# EAGLE design DueShield (EAGLE 9.0.0)
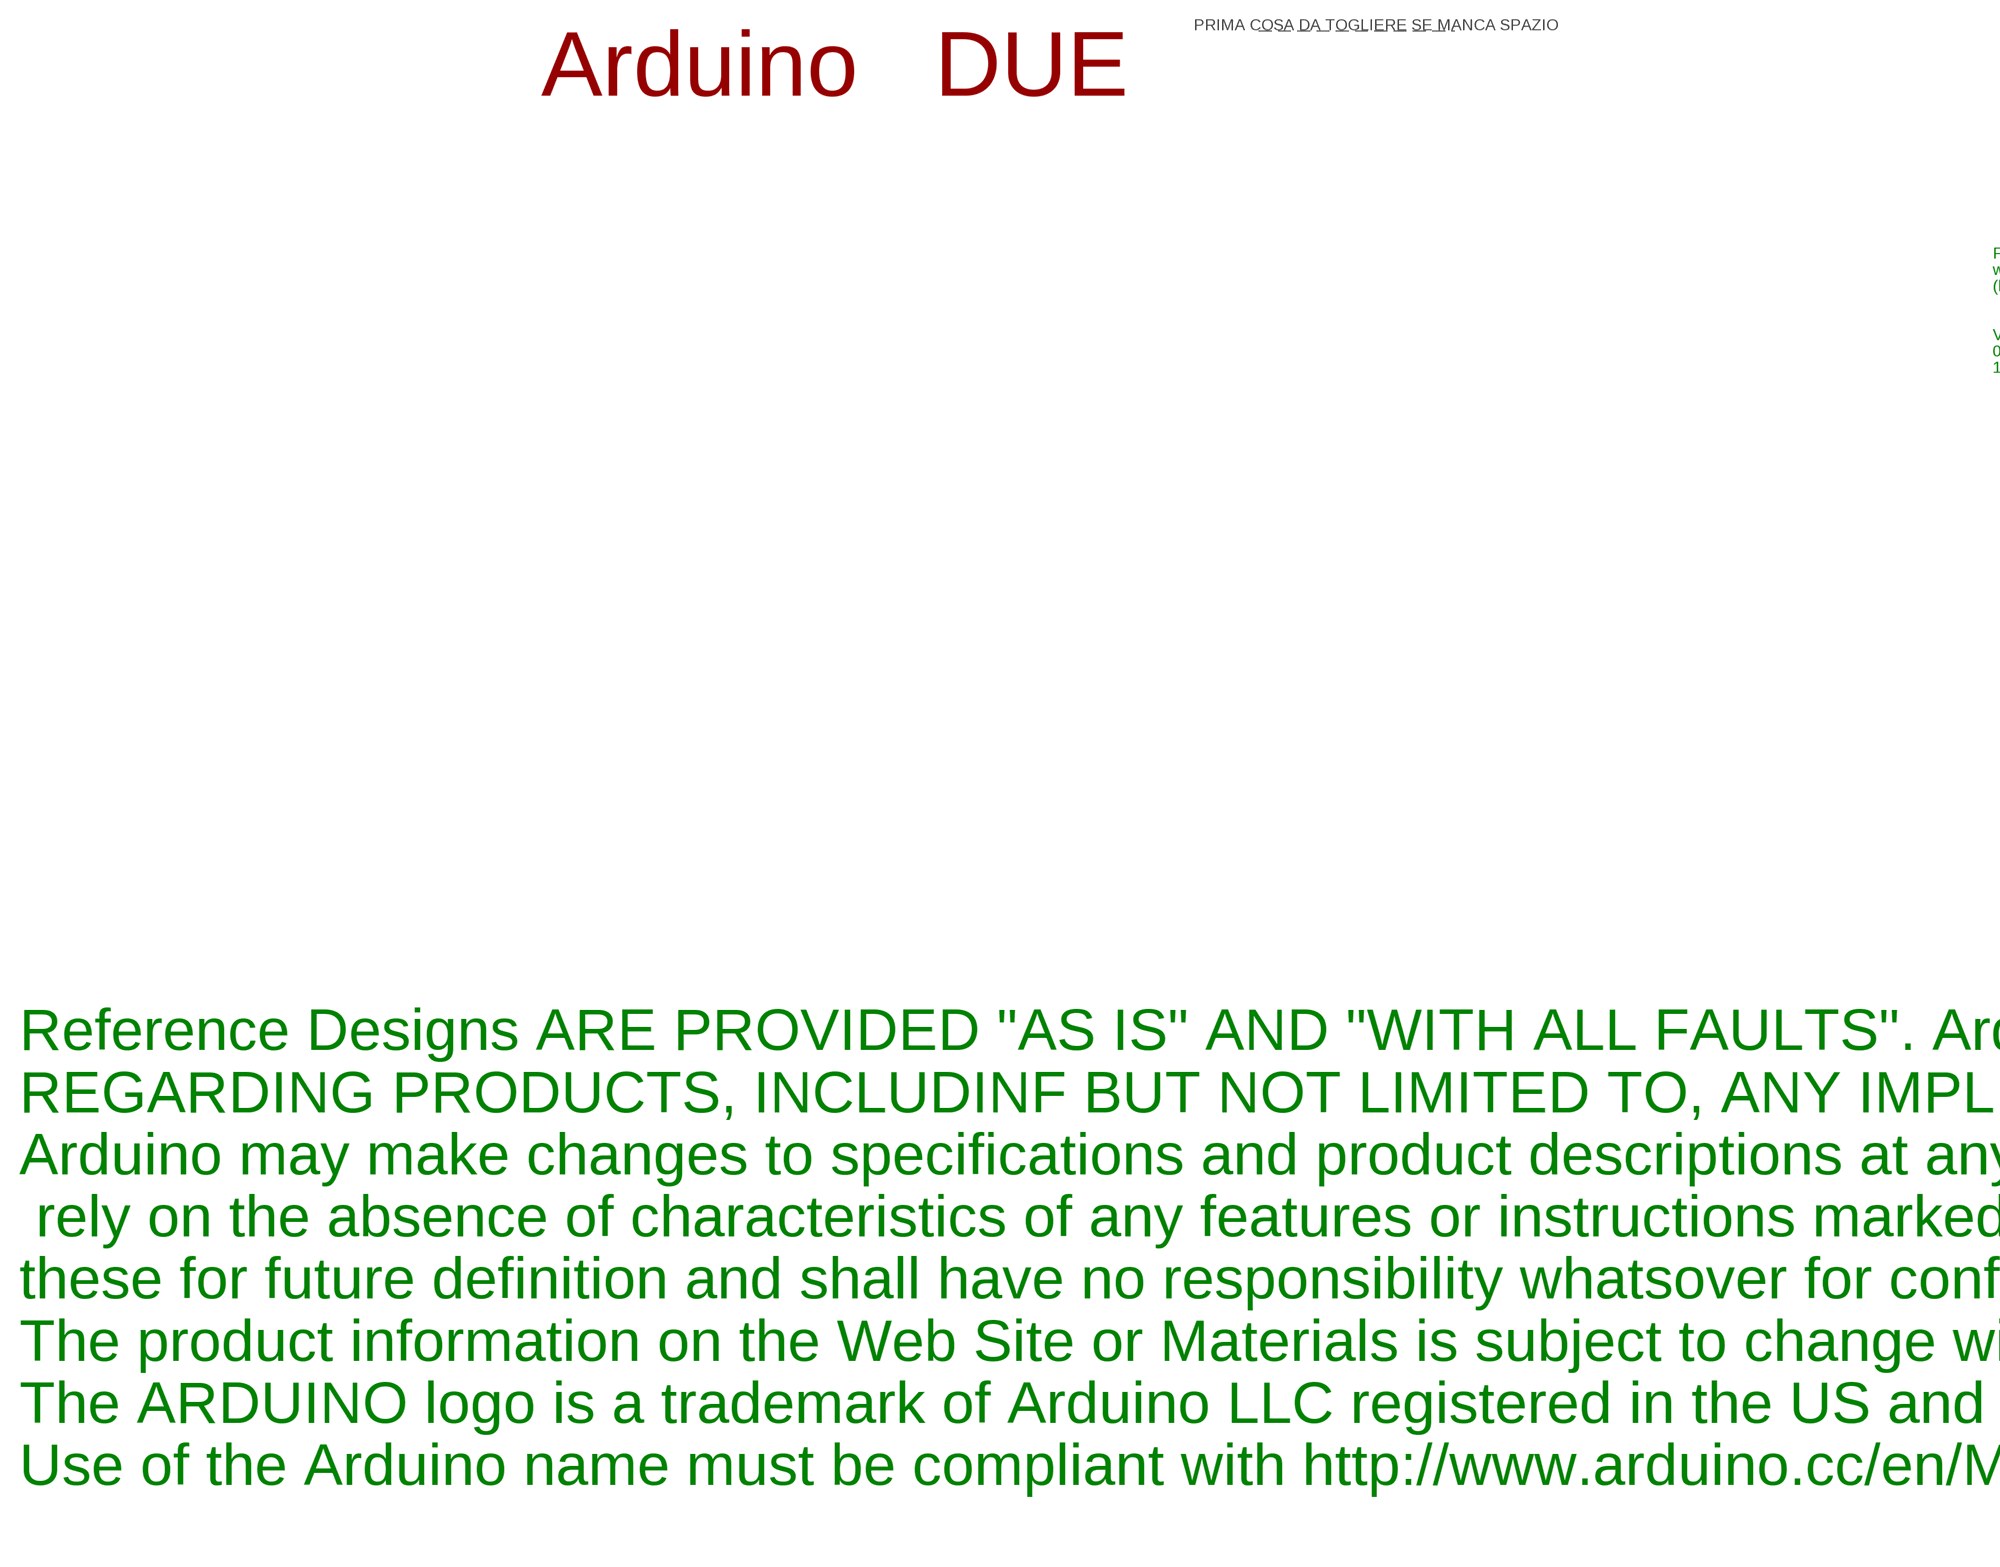
[diagram p0: schematic, sheet 1, part 1 of 2]
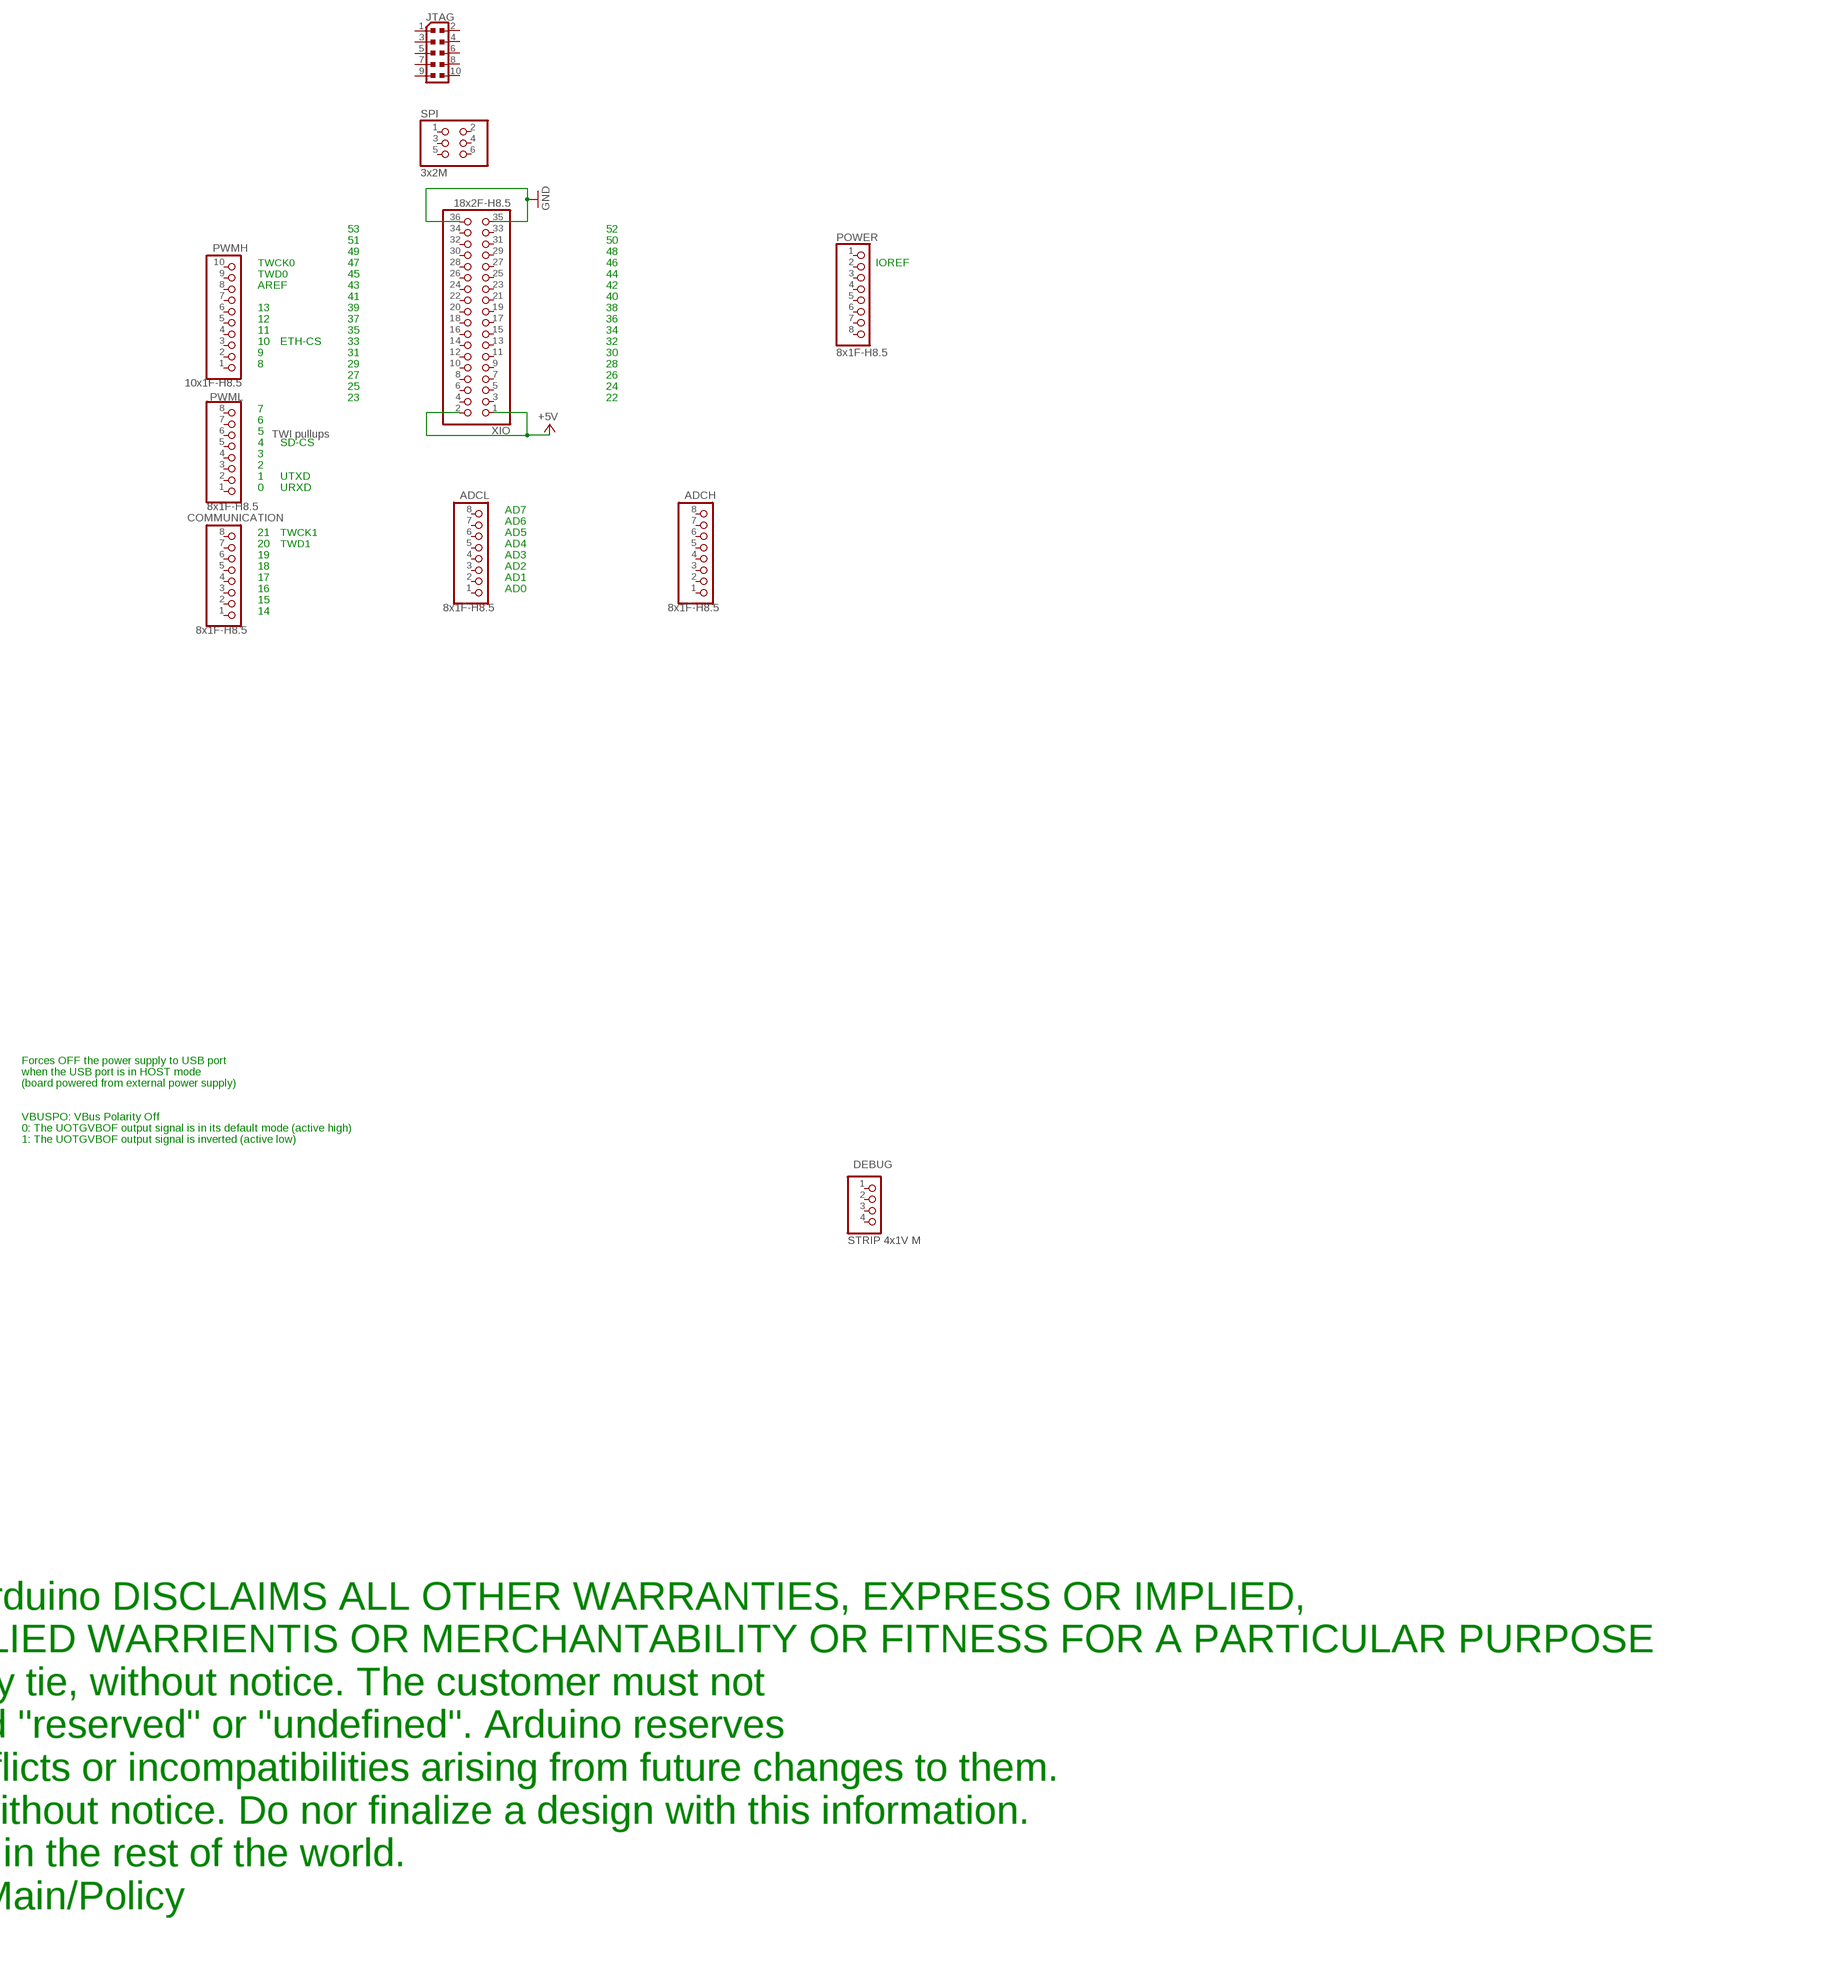
[diagram p1: schematic, sheet 1, part 2 of 2]

## Parts
ADCH  8x1F-H8.5  PINHD-1X8  [1X08]
ADCL  8x1F-H8.5  PINHD-1X8  [1X08]
COMMUNICATION  8x1F-H8.5  PINHD-1X8  [1X08]
DEBUG  STRIP 4x1V M  PINHD-1X4  [1X04]
JTAG  PINHEAD_PINHD-2X5PASSO127  [PINHEAD_2X05_127]
POWER  8x1F-H8.5  PINHD-1X8  [1X08]
PWMH  10x1F-H8.5  PINHD-1X10  [1X10]
PWML  8x1F-H8.5  PINHD-1X8  [1X08]
SPI  3x2M  PINHD-2X3  [2X03]
XIO  18x2F-H8.5  PINHD-2X18  [2X18]

## Nets
+5V: XIO.1 XIO.2
GND: XIO.35 XIO.36
Unconnected: ADCH.1 ADCH.2 ADCH.3 ADCH.4 ADCH.5 ADCH.6 ADCH.7 ADCH.8 ADCL.1 ADCL.2 ADCL.3 ADCL.4 ADCL.5 ADCL.6 ADCL.7 ADCL.8 COMMUNICATION.1 COMMUNICATION.2 COMMUNICATION.3 COMMUNICATION.4 COMMUNICATION.5 COMMUNICATION.6 COMMUNICATION.7 COMMUNICATION.8 DEBUG.1 DEBUG.2 DEBUG.3 DEBUG.4 JTAG.1 JTAG.2 JTAG.3 JTAG.4 JTAG.5 JTAG.6 JTAG.7 JTAG.8 JTAG.9 JTAG.10 POWER.1 POWER.2 POWER.3 POWER.4 POWER.5 POWER.6 POWER.7 POWER.8 PWMH.1 PWMH.2 PWMH.3 PWMH.4 PWMH.5 PWMH.6 PWMH.7 PWMH.8 PWMH.9 PWMH.10 PWML.1 PWML.2 PWML.3 PWML.4 PWML.5 PWML.6 PWML.7 PWML.8 SPI.1 SPI.2 SPI.3 SPI.4 SPI.5 SPI.6 XIO.3 XIO.4 XIO.5 XIO.6 XIO.7 XIO.8 XIO.9 XIO.10 XIO.11 XIO.12 XIO.13 XIO.14 XIO.15 XIO.16 XIO.17 XIO.18 XIO.19 XIO.20 XIO.21 XIO.22 XIO.23 XIO.24 XIO.25 XIO.26 XIO.27 XIO.28 XIO.29 XIO.30 XIO.31 XIO.32 XIO.33 XIO.34

## Notes on the sheet
- 53 | 52
- 51 | 50
- 49 | 48
- TWCK0 | 47 | 46 | IOREF
- TWD0 | 45 | 44
- AREF | 43 | 42
- 41 | 40
- 13 | 39 | 38
- 12 | 37 | 36
- 11 | 35 | 34
- 10 | ETH-CS | 33 | 32
- 9 | 31 | 30
- 8 | 29 | 28
- 27 | 26
- 25 | 24
- 23 | 22
- 7
- 6
- 5 | TWI pullups
- 4 | SD-CS
- 3
- 2
- 1 | UTXD
- 0 | URXD
- AD7
- AD6
- 21 | TWCK1 | AD5
- 20 | TWD1 | AD4
- 19 | AD3
- 18 | AD2
- 17 | AD1
- 16 | AD0
- 15
- 14
- PRIMA COSA DA TOGLIERE SE MANCA SPAZIO
- Arduino   DUE
- Forces OFF the power supply to USB port
- when the USB port is in HOST mode
- (board powered from external power supply)
- VBUSPO: VBus Polarity Off
- 0: The UOTGVBOF output signal is in its default mode (active high)
- 1: The UOTGVBOF output signal is inverted (active low)
- Reference Designs ARE PROVIDED "AS IS" AND "WITH ALL FAULTS". Arduino DISCLAIMS ALL OTHER WARRANTIES, EXPRESS OR IMPLIED,
  REGARDING PRODUCTS, INCLUDINF BUT NOT LIMITED TO, ANY IMPLIED WARRIENTIS OR MERCHANTABILITY OR FITNESS FOR A PARTICULAR PURPOSE
  Arduino may make changes to specifications and product descriptions at any tie, without notice. The customer must not
   rely on the absence of characteristics of any features or instructions marked "reserved" or "undefined". Arduino reserves
  these for future definition and shall have no responsibility whatsover for conflicts or incompatibilities arising from future changes to them.
  The product information on the Web Site or Materials is subject to change without notice. Do nor finalize a design with this information.
  The ARDUINO logo is a trademark of Arduino LLC registered in the US and in the rest of the world.
  Use of the Arduino name must be compliant with http://www.arduino.cc/en/Main/Policy

## Library data of the parts
ADCH ADCL COMMUNICATION POWER PWML = SmartPrj:PINHD-1X8: PIN HEADER
DEBUG = pinhead:PINHD-1X4: PIN HEADER
JTAG = Arduino_Wifi_shield_v018_tG:PINHEAD_PINHD-2X5: PIN HEADER
PWMH = SmartPrj:PINHD-1X10: PIN HEADER
SPI = SmartPrj:PINHD-2X3: PIN HEADER
XIO = SmartPrj:PINHD-2X18: PIN HEADER

## Net classes
0 default: width 0.203 mm, drill 0.406 mm, clearance 0.203 mm
1 USB: width 0.203 mm, drill 0.406 mm, clearance 0.203 mm
2 gnd: width 0.203 mm, drill 0.406 mm, clearance 0.203 mm
3 usbvcc: width 0.203 mm, drill 0.406 mm, clearance 0.203 mm
4 USBpair: width 0.254 mm, drill 0.406 mm, clearance 0.61 mm

## Board
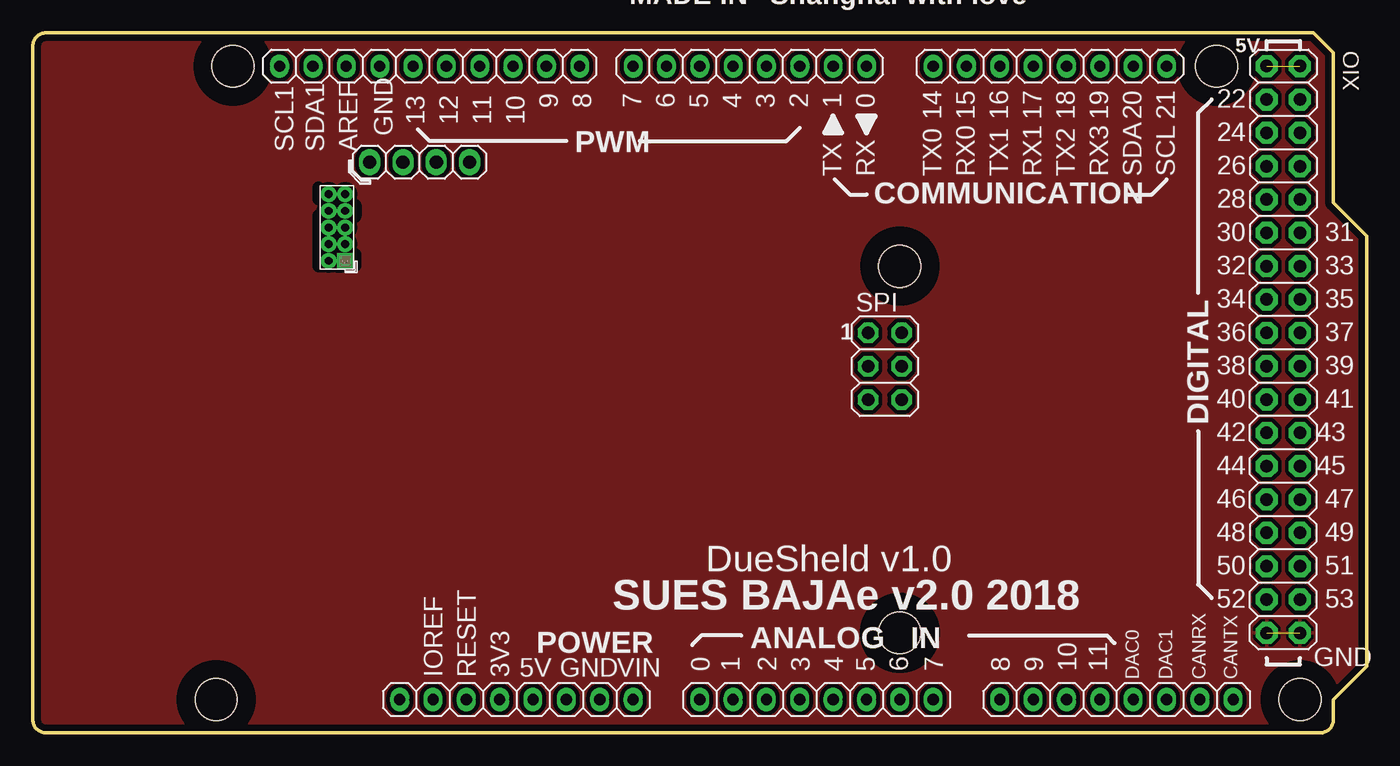
[diagram p2: board, top side]
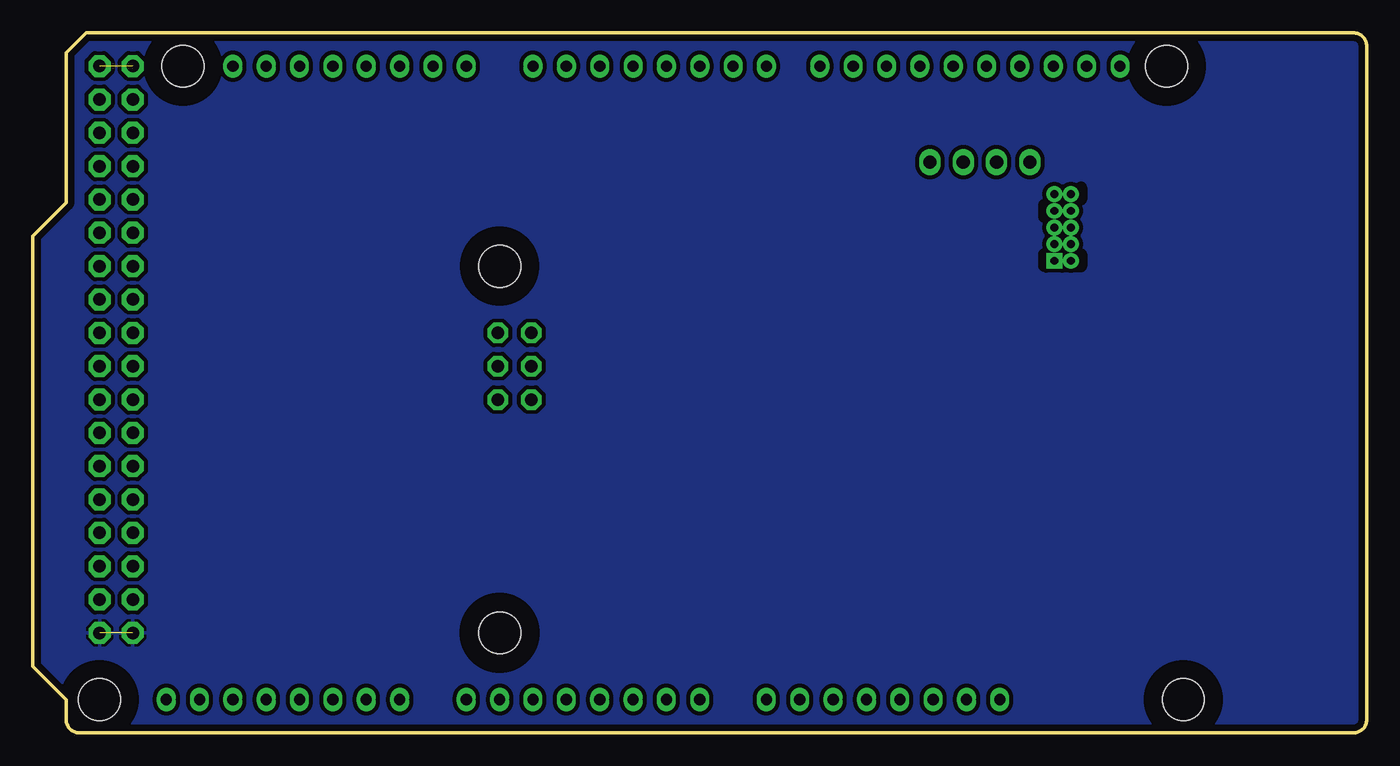
[diagram p3: board, bottom side, seen from below]

Size 101.6 x 53.34 mm. Coordinates in mm from the lower left corner, seen from the top.
Outline: 97.54,53.34 99.06,51.82 99.06,40.39 101.6,37.85 101.6,5.08 99.06,2.54 99.06,1 arc-90 98.06,0 1,0 arc-90 0,1 0,52.34 arc-90 1,53.34 97.54,53.34
Copper layers (1*16): Top 0.035mm / dielectric 1.6mm / Bottom 0.035mm
Design rules "default *": minimum track width 8mil, minimum drill 16mil, track to track 8mil, track to pad 8mil, pad to pad 8mil, via to via 8mil, smd to smd 6mil, copper to edge 20mil, drill to drill 12mil, minimum pad ring 12mil, minimum via ring 8mil, stop-mask expansion 2mil, vias tented up to drill 25mil, thermal gap 8mil
Holes 3.2 mm at 96.52,2.54 15.24,50.8 90.17,50.8 13.97,2.54 66.04,35.56 66.04,7.62
tRestrict: area 63.5,5.1 to 68.6,10.2; area 12.7,48.3 to 17.8,53.3; area 63.5,33 to 68.6,38.1; area 87.6,48.3 to 92.7,53.3; area 94,0 to 99.1,5.1; area 11.4,0 to 16.5,5.1; 5 lines
bRestrict: area 63.5,5.1 to 68.6,10.2; area 12.7,48.3 to 17.8,53.3; area 63.5,33 to 68.6,38.1; area 87.6,48.3 to 92.7,53.3; area 94,0 to 99.1,5.1; area 11.4,0 to 16.5,5.1; 5 lines

### Footprints (pad centres in the part's own frame; a part is rotated, then mirrored left to right if it is on the bottom)
1X08 = drill 0.85 pad 1.422 long: 1 -8.89,0; 2 -6.35,0; 3 -3.81,0; 4 -1.27,0; 5 1.27,0; 6 3.81,0; 7 6.35,0; 8 8.89,0
1X04 = drill 1.016 long: 1 -3.81,0; 2 -1.27,0; 3 1.27,0; 4 3.81,0
PINHEAD_2X05_127 = drill 0.6 pad 1.016 square: 1 -0.635,2.54 | drill 0.6 pad 1.016: 2 0.635,2.54; 3 -0.635,1.27; 4 0.635,1.27; 5 -0.635,0; 6 0.635,0; 7 -0.635,-1.27; 8 0.635,-1.27; 9 -0.635,-2.54; 10 0.635,-2.54
1X10 = drill 0.85 pad 1.422 long: 1 -11.43,0; 2 -8.89,0; 3 -6.35,0; 4 -3.81,0; 5 -1.27,0; 6 1.27,0; 7 3.81,0; 8 6.35,0; 9 8.89,0; 10 11.43,0
2X03 = drill 0.95 pad 1.55 octagon: 1 -2.54,-1.27; 2 -2.54,1.27; 3 0,-1.27; 4 0,1.27; 5 2.54,-1.27; 6 2.54,1.27
2X18 = drill 0.95 pad 1.676 octagon: 1 -21.59,-1.27; 2 -21.59,1.27; 3 -19.05,-1.27; 4 -19.05,1.27; 5 -16.51,-1.27; 6 -16.51,1.27; 7 -13.97,-1.27; 8 -13.97,1.27; 9 -11.43,-1.27; 10 -11.43,1.27; 11 -8.89,-1.27; 12 -8.89,1.27; 13 -6.35,-1.27; 14 -6.35,1.27; 15 -3.81,-1.27; 16 -3.81,1.27; 17 -1.27,-1.27; 18 -1.27,1.27; 19 1.27,-1.27; 20 1.27,1.27; 21 3.81,-1.27; 22 3.81,1.27; 23 6.35,-1.27; 24 6.35,1.27; 25 8.89,-1.27; 26 8.89,1.27; 27 11.43,-1.27; 28 11.43,1.27; 29 13.97,-1.27; 30 13.97,1.27; 31 16.51,-1.27; 32 16.51,1.27; 33 19.05,-1.27; 34 19.05,1.27; 35 21.59,-1.27; 36 21.59,1.27

### Placement (x,y rotation side)
ADCH  82.55,2.54 0 top
ADCL  59.69,2.54 0 top
COMMUNICATION  77.47,50.8 0 top
DEBUG  29.46,43.48 180 top
JTAG  23.16,38.51 180 top
POWER  36.83,2.54 0 top
PWMH  30.23,50.8 180 top
PWML  54.61,50.8 180 top
SPI  64.9,27.94 270 top
XIO  95.25,29.21 270 top

### Tracks (layer width: path | path; a pad name or v marks a point on that pad's centre or on a via)
+5V  (1 unrouted)
GND  (1 unrouted)
  pour Top (isolate 0.305, rank 2): 102.11,53.85 102.11,-0.51 -1.02,-0.51 -1.02,52.83 arc-89 0,53.85
  pour Bottom (isolate 0.305, rank 2): -0.51,54.86 103.12,54.86 103.12,-1.52 -1.52,-1.52 -1.52,53.34 arc-90

### Text on the board
tPlace: 9 | 8 | 7 | 6 | 5 | 4 | 3 | 2 | 1 | 0 | 22 | 14 | 15 | 16 | 17 | 18 | 19 | 20 | 21 | 13 | 12 | 11 | 10 | 24 | 26 | 28 | 30 | 31 | 32 | 33 | 34 | 35 | 36 | 37 | 38 | 39 | 40 | 41 | 42 | 43 | 44 | 45 | 46 | 47 | 48 | 49 | 50 | 51 | 52 | 53 | 0 | 1 | 2 | 3 | 4 | 5 | 6 | 7 | 8 | 9 | 10 | 11 | DAC0 | DAC1 | CANRX | CANTX
tNames: MADE IN | Shanghai with love | 5V | GND | SCL1 | SDA1 | AREF | PWM | TX | RX | TX0 | RX0 | TX1 | RX1 | TX2 | RX3 | SDA | SCL | 1 | DIGITAL | DueSheld v1.0 | SUES BAJAe v2.0 2018 | ANALOG IN | GND | IOREF | RESET | 3V3 | 5V | GND | VIN